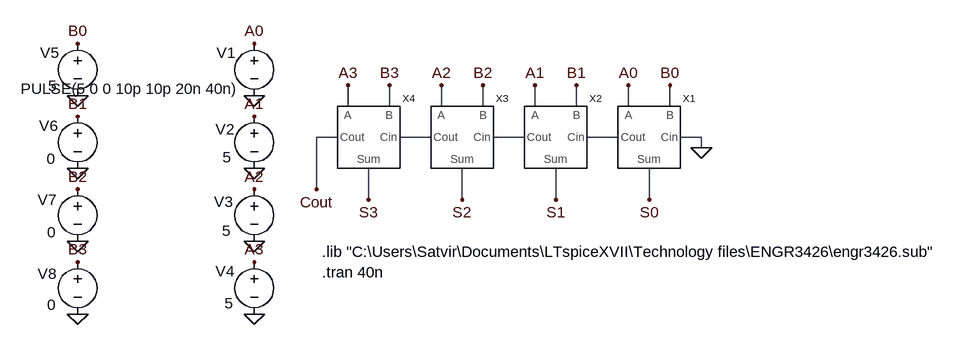
[diagram p0: schematic Ripple_Carry_Adder_TG.asc]
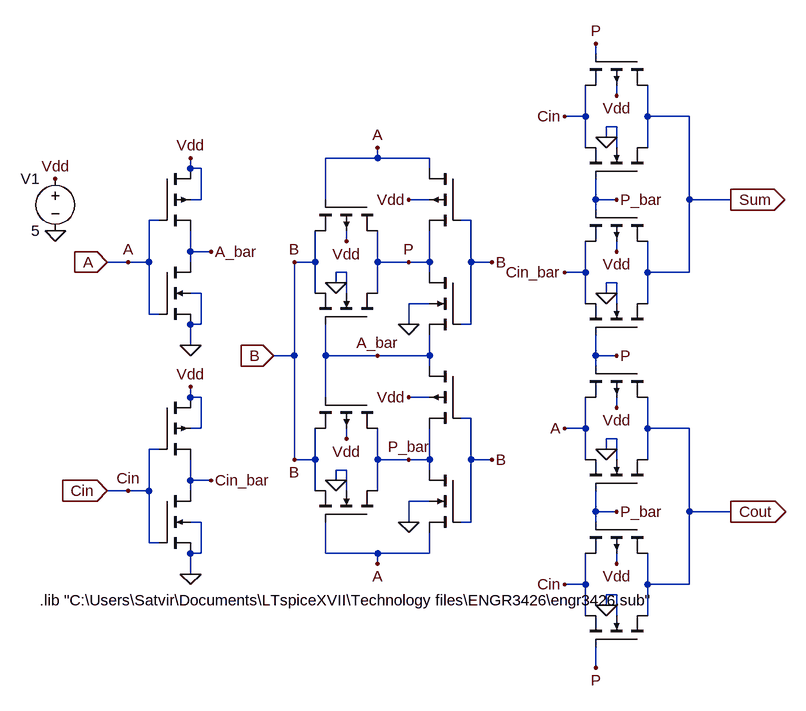
[diagram p1: sub-circuit full_adder_tg.asc]
Ripple_Carry_Adder_TG.asc, the LTspice schematic file:
Version 4
SHEET 1 880 680
WIRE -80 96 -80 64
WIRE -16 96 -16 64
WIRE 64 96 64 64
WIRE 128 96 128 64
WIRE 208 96 208 64
WIRE 272 96 272 64
WIRE 352 96 352 64
WIRE 416 96 416 64
WIRE -96 144 -128 144
WIRE 48 144 0 144
WIRE 192 144 144 144
WIRE 336 144 288 144
WIRE 464 144 432 144
WIRE 464 160 464 144
WIRE -128 224 -128 144
WIRE -48 240 -48 192
WIRE 96 240 96 192
WIRE 240 240 240 192
WIRE 384 240 384 192
FLAG 352 64 A0
FLAG 208 64 A1
FLAG 64 64 A2
FLAG -80 64 A3
FLAG 416 64 B0
FLAG 128 64 B2
FLAG -16 64 B3
FLAG 272 64 B1
FLAG 384 240 S0
FLAG 240 240 S1
FLAG 96 240 S2
FLAG -48 240 S3
FLAG -128 224 Cout
FLAG 464 160 0
FLAG -224 0 A0
FLAG -224 112 A1
FLAG -224 224 A2
FLAG -224 336 A3
FLAG -496 336 B3
FLAG -496 224 B2
FLAG -496 112 B1
FLAG -496 0 B0
FLAG -496 80 0
FLAG -224 80 0
FLAG -496 192 0
FLAG -224 192 0
FLAG -496 304 0
FLAG -224 304 0
FLAG -496 416 0
FLAG -224 416 0
SYMBOL Full_Adder_TG 384 144 R0
SYMATTR InstName X1
SYMBOL Full_Adder_TG 240 144 R0
SYMATTR InstName X2
SYMBOL Full_Adder_TG 96 144 R0
SYMATTR InstName X3
SYMBOL Full_Adder_TG -48 144 R0
SYMATTR InstName X4
SYMBOL voltage -224 -16 M0
WINDOW 0 29 30 Left 2
WINDOW 3 22 85 Left 2
WINDOW 123 0 0 Left 0
WINDOW 39 0 0 Left 0
SYMATTR InstName V1
SYMATTR Value PULSE(5 0 0 10p 10p 20n 40n)
SYMBOL voltage -224 96 M0
WINDOW 0 30 36 Left 2
WINDOW 3 35 79 Left 2
WINDOW 123 0 0 Left 0
WINDOW 39 0 0 Left 0
SYMATTR InstName V2
SYMATTR Value 5
SYMBOL voltage -224 208 M0
WINDOW 0 33 35 Left 2
WINDOW 3 36 80 Left 2
WINDOW 123 0 0 Left 0
WINDOW 39 0 0 Left 0
SYMATTR InstName V3
SYMATTR Value 5
SYMBOL voltage -224 320 M0
WINDOW 0 30 30 Left 2
WINDOW 3 32 79 Left 2
WINDOW 123 0 0 Left 0
WINDOW 39 0 0 Left 0
SYMATTR InstName V4
SYMATTR Value 5
SYMBOL voltage -496 -16 M0
WINDOW 0 28 30 Left 2
WINDOW 3 32 81 Left 2
WINDOW 123 0 0 Left 0
WINDOW 39 0 0 Left 0
SYMATTR InstName V5
SYMATTR Value 5
SYMBOL voltage -496 96 M0
WINDOW 0 30 30 Left 2
WINDOW 3 34 81 Left 2
WINDOW 123 0 0 Left 0
WINDOW 39 0 0 Left 0
SYMATTR InstName V6
SYMATTR Value 0
SYMBOL voltage -496 208 M0
WINDOW 0 32 32 Left 2
WINDOW 3 33 82 Left 2
WINDOW 123 0 0 Left 0
WINDOW 39 0 0 Left 0
SYMATTR InstName V7
SYMATTR Value 0
SYMBOL voltage -496 320 M0
WINDOW 0 32 34 Left 2
WINDOW 3 33 82 Left 2
WINDOW 123 0 0 Left 0
WINDOW 39 0 0 Left 0
SYMATTR InstName V8
SYMATTR Value 0
TEXT -120 320 Left 2 !.lib "C:\\Users\\Satvir\\Documents\\LTspiceXVII\\Technology files\\ENGR3426\\engr3426.sub"
TEXT -120 352 Left 2 !.tran 40n

full_adder_tg.asc, the sub-circuit schematic file:
Version 4
SHEET 1 880 808
WIRE 480 -288 480 -304
WIRE 512 -224 512 -240
WIRE 464 -192 464 -240
WIRE 464 -192 432 -192
WIRE 560 -192 560 -240
WIRE 624 -192 560 -192
WIRE 512 -176 496 -176
WIRE 496 -160 496 -176
WIRE 464 -144 464 -192
WIRE 512 -144 512 -176
WIRE 560 -144 560 -192
WIRE 144 -128 144 -144
WIRE 144 -128 64 -128
WIRE 224 -128 144 -128
WIRE -144 -112 -144 -128
WIRE -128 -112 -144 -112
WIRE 224 -112 224 -128
WIRE -128 -64 -128 -112
WIRE -128 -64 -144 -64
WIRE 64 -64 64 -128
WIRE 224 -64 192 -64
WIRE 480 -64 480 -96
WIRE 512 -64 480 -64
WIRE 624 -64 624 -192
WIRE 688 -64 624 -64
WIRE 480 -48 480 -64
WIRE -192 -32 -208 -32
WIRE 288 -32 272 -32
WIRE 96 0 96 -16
WIRE -144 16 -144 -16
WIRE -112 16 -144 16
WIRE 512 16 512 0
WIRE -240 32 -272 32
WIRE -208 32 -208 -32
WIRE -208 32 -240 32
WIRE -144 32 -144 16
WIRE 48 32 48 -16
WIRE 48 32 16 32
WIRE 144 32 144 -16
WIRE 192 32 144 32
WIRE 224 32 224 -16
WIRE 224 32 192 32
WIRE 288 32 288 -32
WIRE 320 32 288 32
WIRE 96 48 80 48
WIRE 224 48 224 32
WIRE 464 48 464 0
WIRE 464 48 432 48
WIRE 560 48 560 0
WIRE 624 48 624 -64
WIRE 624 48 560 48
WIRE 80 64 80 48
WIRE 512 64 496 64
WIRE -128 80 -144 80
WIRE 48 80 48 32
WIRE 96 80 96 48
WIRE 144 80 144 32
WIRE 496 80 496 64
WIRE 224 96 192 96
WIRE 464 96 464 48
WIRE 512 96 512 64
WIRE 560 96 560 48
WIRE -208 112 -208 32
WIRE -192 112 -208 112
WIRE -128 128 -128 80
WIRE -128 128 -144 128
WIRE 192 128 192 96
WIRE 288 128 288 32
WIRE 288 128 272 128
WIRE -144 160 -144 128
WIRE 16 176 16 32
WIRE 16 176 -16 176
WIRE 64 176 64 128
WIRE 144 176 64 176
WIRE 224 176 224 144
WIRE 224 176 144 176
WIRE 480 176 480 144
WIRE 512 176 480 176
WIRE 224 192 224 176
WIRE 480 192 480 176
WIRE -144 240 -144 224
WIRE -128 240 -144 240
WIRE 64 240 64 176
WIRE 224 240 192 240
WIRE 512 256 512 240
WIRE 288 272 272 272
WIRE -128 288 -128 240
WIRE -128 288 -144 288
WIRE 464 288 464 240
WIRE 464 288 432 288
WIRE 560 288 560 240
WIRE 624 288 560 288
WIRE 96 304 96 288
WIRE 512 304 496 304
WIRE -192 320 -208 320
WIRE 496 320 496 304
WIRE 16 336 16 176
WIRE 48 336 48 288
WIRE 48 336 16 336
WIRE 144 336 144 288
WIRE 192 336 144 336
WIRE 224 336 224 288
WIRE 224 336 192 336
WIRE 288 336 288 272
WIRE 320 336 288 336
WIRE 464 336 464 288
WIRE 512 336 512 304
WIRE 560 336 560 288
WIRE 96 352 80 352
WIRE 224 352 224 336
WIRE -144 368 -144 336
WIRE -112 368 -144 368
WIRE 80 368 80 352
WIRE -240 384 -272 384
WIRE -208 384 -208 320
WIRE -208 384 -240 384
WIRE -144 384 -144 368
WIRE 48 384 48 336
WIRE 96 384 96 352
WIRE 144 384 144 336
WIRE 224 400 192 400
WIRE 480 416 480 384
WIRE 512 416 480 416
WIRE 624 416 624 288
WIRE 688 416 624 416
WIRE -128 432 -144 432
WIRE 192 432 192 400
WIRE 288 432 288 336
WIRE 288 432 272 432
WIRE 480 432 480 416
WIRE -208 464 -208 384
WIRE -192 464 -208 464
WIRE -128 480 -128 432
WIRE -128 480 -144 480
WIRE 64 480 64 432
WIRE 144 480 64 480
WIRE 224 480 224 448
WIRE 224 480 144 480
WIRE 144 496 144 480
WIRE 512 496 512 480
WIRE -144 512 -144 480
WIRE 464 528 464 480
WIRE 464 528 432 528
WIRE 560 528 560 480
WIRE 624 528 624 416
WIRE 624 528 560 528
WIRE 512 544 496 544
WIRE 496 560 496 544
WIRE 464 576 464 528
WIRE 512 576 512 544
WIRE 560 576 560 528
WIRE 480 656 480 624
FLAG 80 64 0
FLAG 96 0 Vdd
FLAG 144 -144 A
FLAG 144 176 A_bar
FLAG 320 32 B
FLAG 16 32 B
FLAG 192 128 0
FLAG 192 -64 Vdd
FLAG 192 32 P
FLAG -144 160 0
FLAG -112 16 A_bar
FLAG -144 -128 Vdd
FLAG -352 -16 0
FLAG -352 -96 Vdd
FLAG 80 368 0
FLAG 96 304 Vdd
FLAG 144 496 A
FLAG 320 336 B
FLAG 16 336 B
FLAG 192 432 0
FLAG 192 240 Vdd
FLAG 192 336 P_bar
FLAG -144 512 0
FLAG -112 368 Cin_bar
FLAG -144 224 Vdd
FLAG 496 -160 0
FLAG 512 -224 Vdd
FLAG 432 -192 Cin
FLAG 496 80 0
FLAG 512 16 Vdd
FLAG 432 48 Cin_bar
FLAG 496 320 0
FLAG 512 256 Vdd
FLAG 432 288 A
FLAG 496 560 0
FLAG 512 496 Vdd
FLAG 432 528 Cin
FLAG 512 -64 P_bar
FLAG 480 -304 P
FLAG 512 176 P
FLAG 512 416 P_bar
FLAG 480 656 P
FLAG -272 32 A
IOPIN -272 32 In
FLAG -272 384 Cin
IOPIN -272 384 In
FLAG -16 176 B
IOPIN -16 176 In
FLAG -240 32 A
FLAG -240 384 Cin
FLAG 688 -64 Sum
IOPIN 688 -64 Out
FLAG 688 416 Cout
IOPIN 688 416 Out
SYMBOL pmos4 144 -64 R90
WINDOW 0 56 32 Invisible 2
WINDOW 3 56 72 Invisible 2
SYMATTR InstName M1
SYMATTR Value C5NPMOS
SYMATTR Value2 l=0.6u w=1.8u
SYMBOL nmos4 144 128 M270
WINDOW 0 56 32 Invisible 2
WINDOW 3 56 72 Invisible 2
SYMATTR InstName M2
SYMATTR Value C5NNMOS
SYMATTR Value2 l=0.6u w=1.8u
SYMBOL pmos4 272 -112 M0
WINDOW 0 56 32 Invisible 2
WINDOW 3 56 72 Invisible 2
SYMATTR InstName M3
SYMATTR Value C5NPMOS
SYMATTR Value2 l=0.6u w=5.04u
SYMBOL nmos4 272 48 M0
WINDOW 0 56 32 Invisible 2
WINDOW 3 56 72 Invisible 2
SYMATTR InstName M4
SYMATTR Value C5NNMOS
SYMATTR Value2 l=0.6u w=1.8u
SYMBOL pmos4 -192 -112 R0
WINDOW 0 56 32 Invisible 2
WINDOW 3 56 72 Invisible 2
SYMATTR InstName M5
SYMATTR Value C5NPMOS
SYMATTR Value2 l=0.6u w=5.04u
SYMBOL nmos4 -192 32 R0
WINDOW 0 56 32 Invisible 2
WINDOW 3 56 72 Invisible 2
SYMATTR InstName M6
SYMATTR Value C5NNMOS
SYMATTR Value2 l=0.6u w=1.8u
SYMBOL voltage -352 -112 M0
WINDOW 123 0 0 Left 0
WINDOW 39 0 0 Left 0
SYMATTR InstName V1
SYMATTR Value 5
SYMBOL pmos4 144 240 R90
WINDOW 0 56 32 Invisible 2
WINDOW 3 56 72 Invisible 2
SYMATTR InstName M7
SYMATTR Value C5NPMOS
SYMATTR Value2 l=0.6u w=1.8u
SYMBOL nmos4 144 432 M270
WINDOW 0 56 32 Invisible 2
WINDOW 3 56 72 Invisible 2
SYMATTR InstName M8
SYMATTR Value C5NNMOS
SYMATTR Value2 l=0.6u w=1.8u
SYMBOL pmos4 272 192 M0
WINDOW 0 56 32 Invisible 2
WINDOW 3 56 72 Invisible 2
SYMATTR InstName M9
SYMATTR Value C5NPMOS
SYMATTR Value2 l=0.6u w=5.04u
SYMBOL nmos4 272 352 M0
WINDOW 0 56 32 Invisible 2
WINDOW 3 56 72 Invisible 2
SYMATTR InstName M10
SYMATTR Value C5NNMOS
SYMATTR Value2 l=0.6u w=1.8u
SYMBOL pmos4 -192 240 R0
WINDOW 0 56 32 Invisible 2
WINDOW 3 56 72 Invisible 2
SYMATTR InstName M11
SYMATTR Value C5NPMOS
SYMATTR Value2 l=0.6u w=5.04u
SYMBOL nmos4 -192 384 R0
WINDOW 0 56 32 Invisible 2
WINDOW 3 56 72 Invisible 2
SYMATTR InstName M12
SYMATTR Value C5NNMOS
SYMATTR Value2 l=0.6u w=1.8u
SYMBOL pmos4 560 -288 R90
WINDOW 0 56 32 Invisible 2
WINDOW 3 56 72 Invisible 2
SYMATTR InstName M13
SYMATTR Value C5NPMOS
SYMATTR Value2 l=0.6u w=1.8u
SYMBOL nmos4 560 -96 M270
WINDOW 0 56 32 Invisible 2
WINDOW 3 56 72 Invisible 2
SYMATTR InstName M14
SYMATTR Value C5NNMOS
SYMATTR Value2 l=0.6u w=1.8u
SYMBOL pmos4 560 -48 R90
WINDOW 0 56 32 Invisible 2
WINDOW 3 56 72 Invisible 2
SYMATTR InstName M15
SYMATTR Value C5NPMOS
SYMATTR Value2 l=0.6u w=1.8u
SYMBOL nmos4 560 144 M270
WINDOW 0 56 32 Invisible 2
WINDOW 3 56 72 Invisible 2
SYMATTR InstName M16
SYMATTR Value C5NNMOS
SYMATTR Value2 l=0.6u w=1.8u
SYMBOL pmos4 560 192 R90
WINDOW 0 56 32 Invisible 2
WINDOW 3 56 72 Invisible 2
SYMATTR InstName M17
SYMATTR Value C5NPMOS
SYMATTR Value2 l=0.6u w=1.8u
SYMBOL nmos4 560 384 M270
WINDOW 0 56 32 Invisible 2
WINDOW 3 56 72 Invisible 2
SYMATTR InstName M18
SYMATTR Value C5NNMOS
SYMATTR Value2 l=0.6u w=1.8u
SYMBOL pmos4 560 432 R90
WINDOW 0 56 32 Invisible 2
WINDOW 3 56 72 Invisible 2
SYMATTR InstName M19
SYMATTR Value C5NPMOS
SYMATTR Value2 l=0.6u w=1.8u
SYMBOL nmos4 560 624 M270
WINDOW 0 56 32 Invisible 2
WINDOW 3 56 72 Invisible 2
SYMATTR InstName M20
SYMATTR Value C5NNMOS
SYMATTR Value2 l=0.6u w=1.8u
TEXT -376 552 Left 2 !.lib "C:\\Users\\Satvir\\Documents\\LTspiceXVII\\Technology files\\ENGR3426\\engr3426.sub"

The netlist it stands for:
* Ripple_Carry_Adder_TG.asc
XX1 A0 B0 0 N003 S0 full_adder_tg
XX2 A1 B1 N003 N002 S1 full_adder_tg
XX3 A2 B2 N002 N001 S2 full_adder_tg
XX4 A3 B3 N001 Cout S3 full_adder_tg
V1 A0 0 PULSE(5 0 0 10p 10p 20n 40n)
V2 A1 0 5
V3 A2 0 5
V4 A3 0 5
V5 B0 0 5
V6 B1 0 0
V7 B2 0 0
V8 B3 0 0

* block symbol definitions
.subckt full_adder_tg A B Cin Cout Sum
M1 P A B Vdd C5NPMOS l=0.6u w=1.8u
M2 P A_bar B 0 C5NNMOS l=0.6u w=1.8u
M3 A B P Vdd C5NPMOS l=0.6u w=5.04u
M4 P B A_bar 0 C5NNMOS l=0.6u w=1.8u
M5 Vdd A A_bar Vdd C5NPMOS l=0.6u w=5.04u
M6 A_bar A 0 0 C5NNMOS l=0.6u w=1.8u
V1 Vdd 0 5
M7 P_bar A_bar B Vdd C5NPMOS l=0.6u w=1.8u
M8 P_bar A B 0 C5NNMOS l=0.6u w=1.8u
M9 A_bar B P_bar Vdd C5NPMOS l=0.6u w=5.04u
M10 P_bar B A 0 C5NNMOS l=0.6u w=1.8u
M11 Vdd Cin Cin_bar Vdd C5NPMOS l=0.6u w=5.04u
M12 Cin_bar Cin 0 0 C5NNMOS l=0.6u w=1.8u
M13 Sum P Cin Vdd C5NPMOS l=0.6u w=1.8u
M14 Sum P_bar Cin 0 C5NNMOS l=0.6u w=1.8u
M15 Sum P_bar Cin_bar Vdd C5NPMOS l=0.6u w=1.8u
M16 Sum P Cin_bar 0 C5NNMOS l=0.6u w=1.8u
M17 Cout P A Vdd C5NPMOS l=0.6u w=1.8u
M18 Cout P_bar A 0 C5NNMOS l=0.6u w=1.8u
M19 Cout P_bar Cin Vdd C5NPMOS l=0.6u w=1.8u
M20 Cout P Cin 0 C5NNMOS l=0.6u w=1.8u
.lib "C:\Users\Satvir\Documents\LTspiceXVII\Technology files\ENGR3426\engr3426.sub"
.ends full_adder_tg

.model NMOS NMOS
.model PMOS PMOS
.lib standard.mos
.lib "C:\Users\Satvir\Documents\LTspiceXVII\Technology files\ENGR3426\engr3426.sub"
.tran 40n
.backanno
.end